# Altium schematic sheet Power_USB.SchDoc
size A4; PageSetup: Record=PageOptions|CenterHorizontal=True|CenterVertical=True|PrintScale=0.91|XCorrection=1.00|YCorrection=1.00|PrintKind=1|BorderSize=5000000|LeftOffset=0|BottomOffset=0|Orientation=2|PaperLength=1000|PaperWidth=1000|Scale=100|PaperSource=15|PrintQuality=600|MediaType=1|DitherType=10|PrintScaleMode=1|PaperKind=Letter
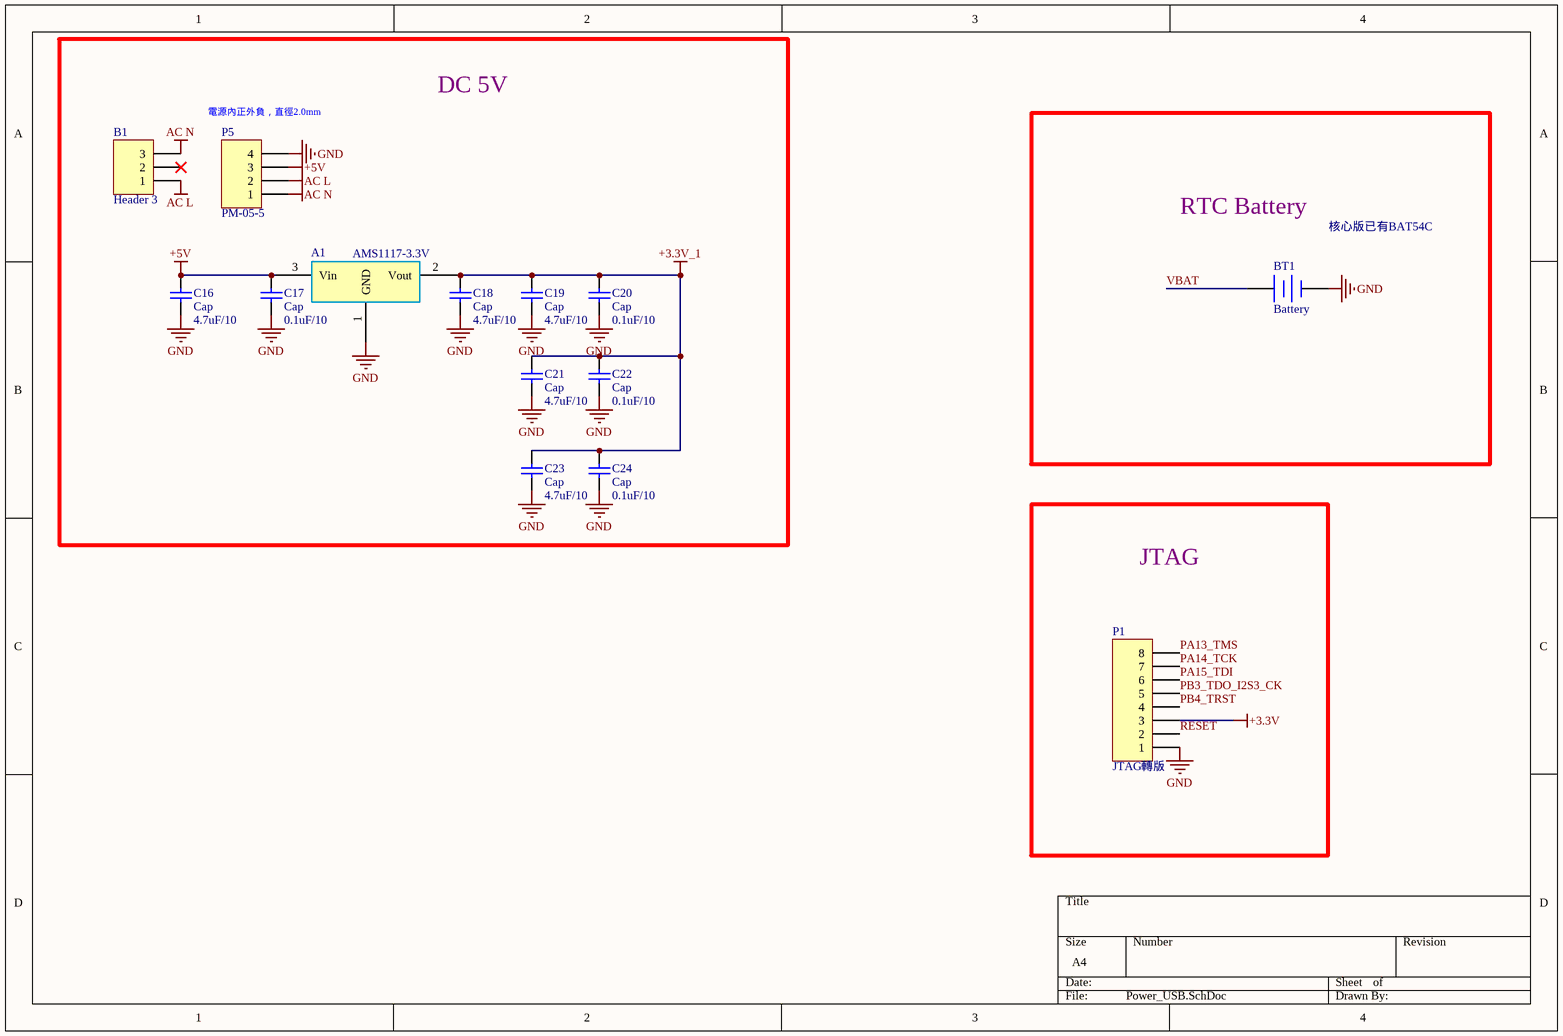
[diagram p0: Power_USB.SchDoc]

## Parts
A1  AMS1117-3.3V  [AMS1117-3.3]
B1  Header 3  [歐式端子*3p]
BT1  Battery  [CR1220 battery holder]
C16  Cap  value 4.7uF/10  [0805]
C17  Cap  value 0.1uF/10  [0805]
C18  Cap  value 4.7uF/10  [0805]
C19  Cap  value 4.7uF/10  [0805]
C20  Cap  value 0.1uF/10  [0805]
C21  Cap  value 4.7uF/10  [0805]
C22  Cap  value 0.1uF/10  [0805]
C23  Cap  value 4.7uF/10  [0805]
C24  Cap  value 0.1uF/10  [0805]
P1  JTAG轉版  [HDR1X8]
P5  PM-05-5  [MW PM-05-5]

## Blocks framed on the sheet
DC 5V: A1 B1 C16-C24 P5
RTC Battery: BT1
JTAG: P1

## Nets
+3.3V: P1.3
+3.3V_1: A1.2(Vout) C18.1 C19.1 C20.1 C21.1 C22.1 C23.1 C24.1
+5V: A1.3(Vin) C16.1 C17.1 P5.3
AC L: B1.1 P5.2
AC N: B1.3 P5.1
GND: A1.1(GND) BT1.2(-) C16.2 C17.2 C18.2 C19.2 C20.2 C21.2 C22.2 C23.2 C24.2 P1.1 P5.4
PA13_TMS: P1.8
PA14_TCK: P1.7
PA15_TDI: P1.6
PB3_TDO_I2S3_CK: P1.5
PB4_TRST: P1.4
RESET: P1.2
VBAT: BT1.1(+)

Not connected (* = marked no-connect by the designer): B1 2*

## Notes on the sheet
- (near P5) 電源內正外負，直徑2.0mm
- 核心版已有BAT54C

## Library data of the parts
B1 = Header 3: Header, 3-Pin; LatestRevisionDate: 17-Jul-2002; LatestRevisionNote: Re-released for DXP Platform.; Publisher: Altium Limited
BT1 = Battery: Multicell Battery; Published: 24-Mar-1999; LatestRevisionDate: 17-Jul-2002; LatestRevisionNote: Re-released for DXP Platform.; PackageReference: BAT-2; Publisher: Altium Limited; PackageDescription: Battery; 2 Leads
C16-C24 = Cap: Capacitor; Published: 8-Jun-2000; LatestRevisionDate: 17-Jul-2002; LatestRevisionNote: Re-released for DXP Platform.; PackageReference: RAD-0.3; Publisher: Altium Limited; PackageDescription: Radial Cap, Thru-Hole; 2 Leads; 0.3 in Pin Spacing
P1 = Header 8: Header, 8-Pin; LatestRevisionDate: 17-Jul-2002; LatestRevisionNote: Re-released for DXP Platform.; Publisher: Altium Limited
P5 = Header 4: Header, 4-Pin; LatestRevisionDate: 17-Jul-2002; LatestRevisionNote: Re-released for DXP Platform.; Publisher: Altium Limited